# EAGLE design Snake Game (EAGLE 9.6.2)
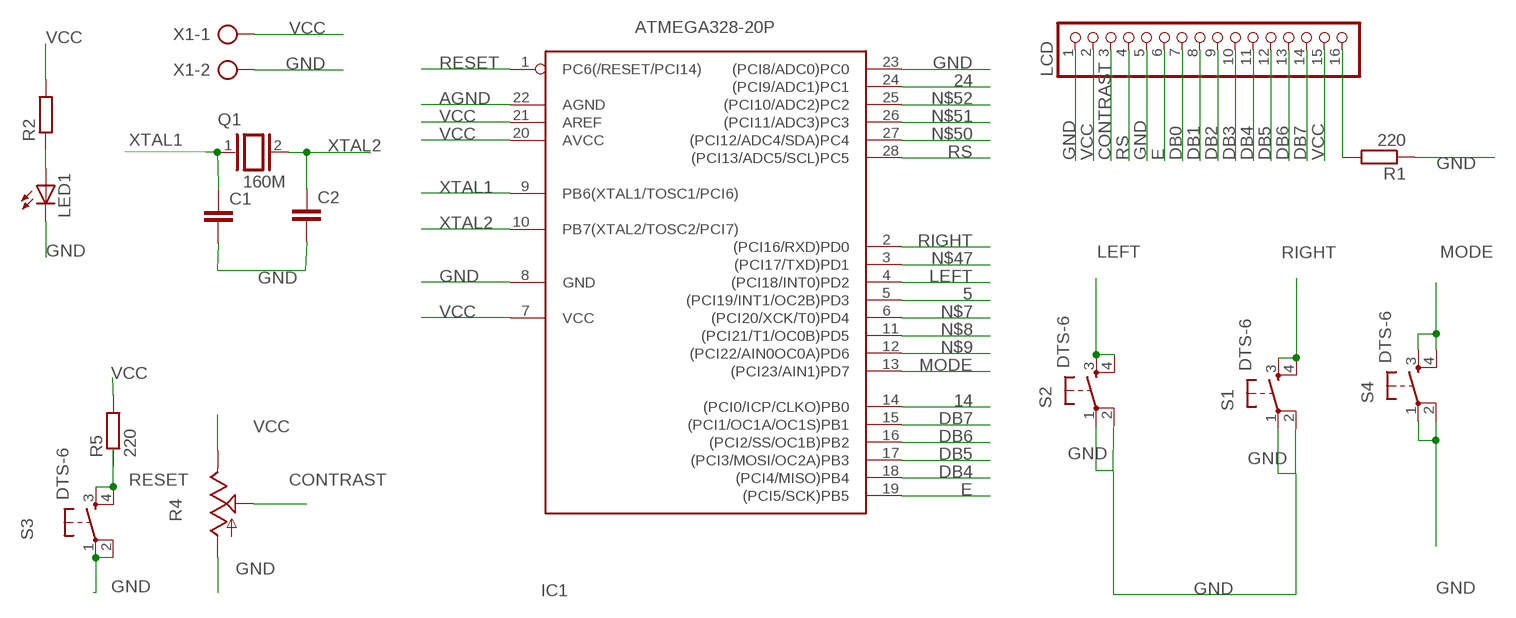
[diagram p0: schematic, sheet 1]

## Parts
C1  C2.5/2  [C2.5-2]
C2  C2.5/2  [C2.5-2]
IC1  ATMEGA328-20P  [DIL28-3]
LCD  PINHD-1X16  [1X16]
LED1  LED_LED3MM  [LED_LED3MM]
Q1  160M  XTAL/S  [QS]
R1  220  R-EU_0204/7  [0204/7]
R2  RCL_R-EU_0204/7  [RCL_0204/7]
R4  TRIM_US-B25P  [B25P]
R5  220  R-EU_0204/7  [0204/7]
S1  DTS-6  [DTS-6]
S2  DTS-6  [DTS-6]
S3  DTS-6  [DTS-6]
S4  DTS-6  [DTS-6]
X1  AK300/2  [AK300/2]

## Nets
5: IC1.5((PCI19/INT1/OC2B)PD3)
14: IC1.14((PCI0/ICP/CLKO)PB0)
24: IC1.24((PCI9/ADC1)PC1)
AGND: IC1.22(AGND)
CONTRAST: LCD.3 R4.S
DB0: LCD.7
DB1: LCD.8
DB2: LCD.9
DB3: LCD.10
DB4: IC1.18((PCI4/MISO)PB4) LCD.11
DB5: IC1.17((PCI3/MOSI/OC2A)PB3) LCD.12
DB6: IC1.16((PCI2/SS/OC1B)PB2) LCD.13
DB7: IC1.15((PCI1/OC1A/OC1S)PB1) LCD.14
E: IC1.19((PCI5/SCK)PB5) LCD.6
GND: C1.2 C2.2 IC1.8(GND) IC1.23((PCI8/ADC0)PC0) LCD.1 LCD.5 LED1.K(C) R1.1 R4.A S1.1 S1.2 S2.1 S2.2 S3.1 S3.2 S4.1 S4.2 X1.2
LEFT: IC1.4((PCI18/INT0)PD2) S2.3 S2.4
MODE: IC1.13((PCI23/AIN1)PD7) S4.3 S4.4
N$1: LCD.16 R1.2
N$3: LED1.A R2.1
N$7: IC1.6((PCI20/XCK/T0)PD4)
N$8: IC1.11((PCI21/T1/OC0B)PD5)
N$9: IC1.12((PCI22/AIN0OC0A)PD6)
N$47: IC1.3((PCI17/TXD)PD1)
N$50: IC1.27((PCI12/ADC4/SDA)PC4)
N$51: IC1.26((PCI11/ADC3)PC3)
N$52: IC1.25((PCI10/ADC2)PC2)
RESET: IC1.1(PC6(/RESET/PCI14)) R5.1 S3.3 S3.4
RIGHT: IC1.2((PCI16/RXD)PD0) S1.3 S1.4
RS: IC1.28((PCI13/ADC5/SCL)PC5) LCD.4
VCC: IC1.7(VCC) IC1.20(AVCC) IC1.21(AREF) LCD.2 LCD.15 R2.2 R4.E R5.2 X1.1
XTAL1: C1.1 IC1.9(PB6(XTAL1/TOSC1/PCI6)) Q1.1
XTAL2: C2.1 IC1.10(PB7(XTAL2/TOSC2/PCI7)) Q1.2

## Library data of the parts
C1 C2 = capacitor-wima:C: CAPACITOR naming: grid - package width
IC1 = atmega328:ATMEGA328*P: MICROCONTROLLER 32 kBytes FLASH 2 kBytes SRAM 1 kBytes EEPROM USART 8-channel 10 bit ADC
LCD = pinhead:PINHD-1X16: PIN HEADER
LED1 = MindCloud:LED_LED: LED OSRAM: - CHIPLED LG R971, LG N971, LY N971, LG Q971, LY Q971, LO R971, LY R971 LH N974, LH R974 LS Q976, LO Q976, LY Q976 LO Q996 - Hyper CHIPLED LW Q18S LB Q993, LB Q99A, LB R99A - SideLED LS A670, LO A670, LY A670, LG A670, LP A670 LB A673, LV A673, LT A673, LW A673 LH A674 LY A675 LS A676, LA A676, LO A676, LY A676, LW A676 LS A679, LY A679, LG A679 - Hyper Micro SIDELED® LS Y876, LA Y876, LO Y876, LY Y876 LT Y87S - SmartLED LW L88C, LW L88S LB L89C, LB L89S, LG L890 LS L89K, LO L89K, LY L89K LS L896, LA L896, LO L896, LY L896 - TOPLED LS T670, LO T670, LY T670, LG T670, LP T670 LSG T670, LSP T670, LSY T670, LOP T670, LYG T670 LG T671, LOG T671, LSG T671 LB T673, LV T673, LT T673, LW T673 LH T674 LS T676, LA T676, LO T676, LY T676, LB T676, LH T676, LSB T676, LW T676 LB T67C, LV T67C, LT T67C, LS T67K, LO T67K, LY T67K, LW E67C LS E67B, LA E67B, LO E67B, LY E67B, LB E67C, LV E67C, LT E67C LW T67C LS T679, LY T679, LG T679 LS T770, LO T770, LY T770, LG T770, LP T770 LB T773, LV T773, LT T773, LW T773 LH T774 LS E675, LA E675, LY E675, LS T675 LS T776, LA T776, LO T776, LY T776, LB T776 LHGB T686 LT T68C, LB T68C - Hyper Mini TOPLED® LB M676 - Mini TOPLED Santana® LG M470 LS M47K, LO M47K, LY M47K Source: http://www.osram.convergy.de LUXEON: - LUMILED® LXK2-PW12-R00, LXK2-PW12-S00, LXK2-PW14-U00, LXK2-PW14-V00 LXK2-PM12-R00, LXK2-PM12-S00, LXK2-PM14-U00 LXK2-PE12-Q00, LXK2-PE12-R00, LXK2-PE12-S00, LXK2-PE14-T00, LXK2-PE14-U00 LXK2-PB12-K00, LXK2-PB12-L00, LXK2-PB12-M00, LXK2-PB14-N00, LXK2-PB14-P00, LXK2-PB14-Q00 LXK2-PR12-L00, LXK2-PR12-M00, LXK2-PR14-Q00, LXK2-PR14-R00 LXK2-PD12-Q00, LXK2-PD12-R00, LXK2-PD12-S00 LXK2-PH12-R00, LXK2-PH12-S00 LXK2-PL12-P00, LXK2-PL12-Q00, LXK2-PL12-R00 Source: www.luxeon.com KINGBRIGHT: KA-3528ASYC Source: www.kingbright.com
Q1 = special:XTAL/S: CRYSTAL
R1 R5 = Eagle Training:R-EU_: RESISTOR, European symbol; SPICEPREFIX: R
R2 = MindCloud:RCL_R-EU_: RESISTOR, European symbol; SPICEPREFIX: R
R4 = pot:TRIM_US-: POTENTIOMETER
S1-S4 = switch-tact:DTS-6
X1 = con-ptr500:AK300/2: CONNECTOR; OC_FARNELL: unknown; OC_NEWARK: unknown

## Board
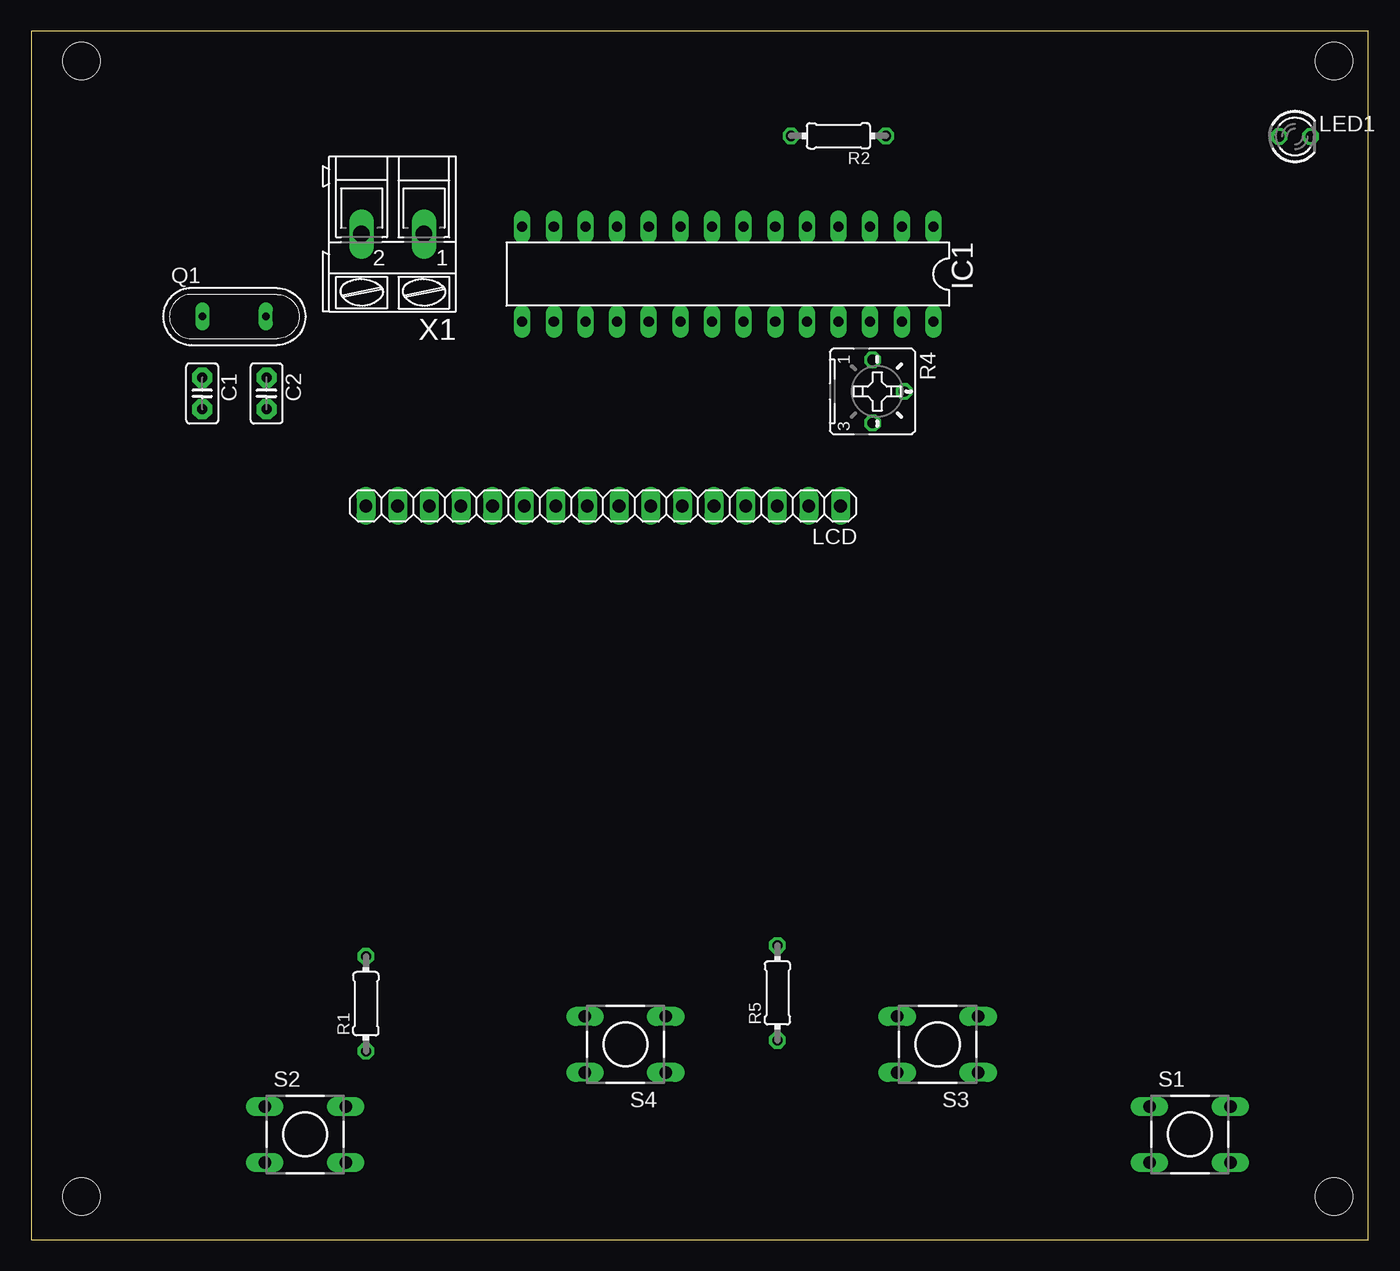
[diagram p1: board, top side]
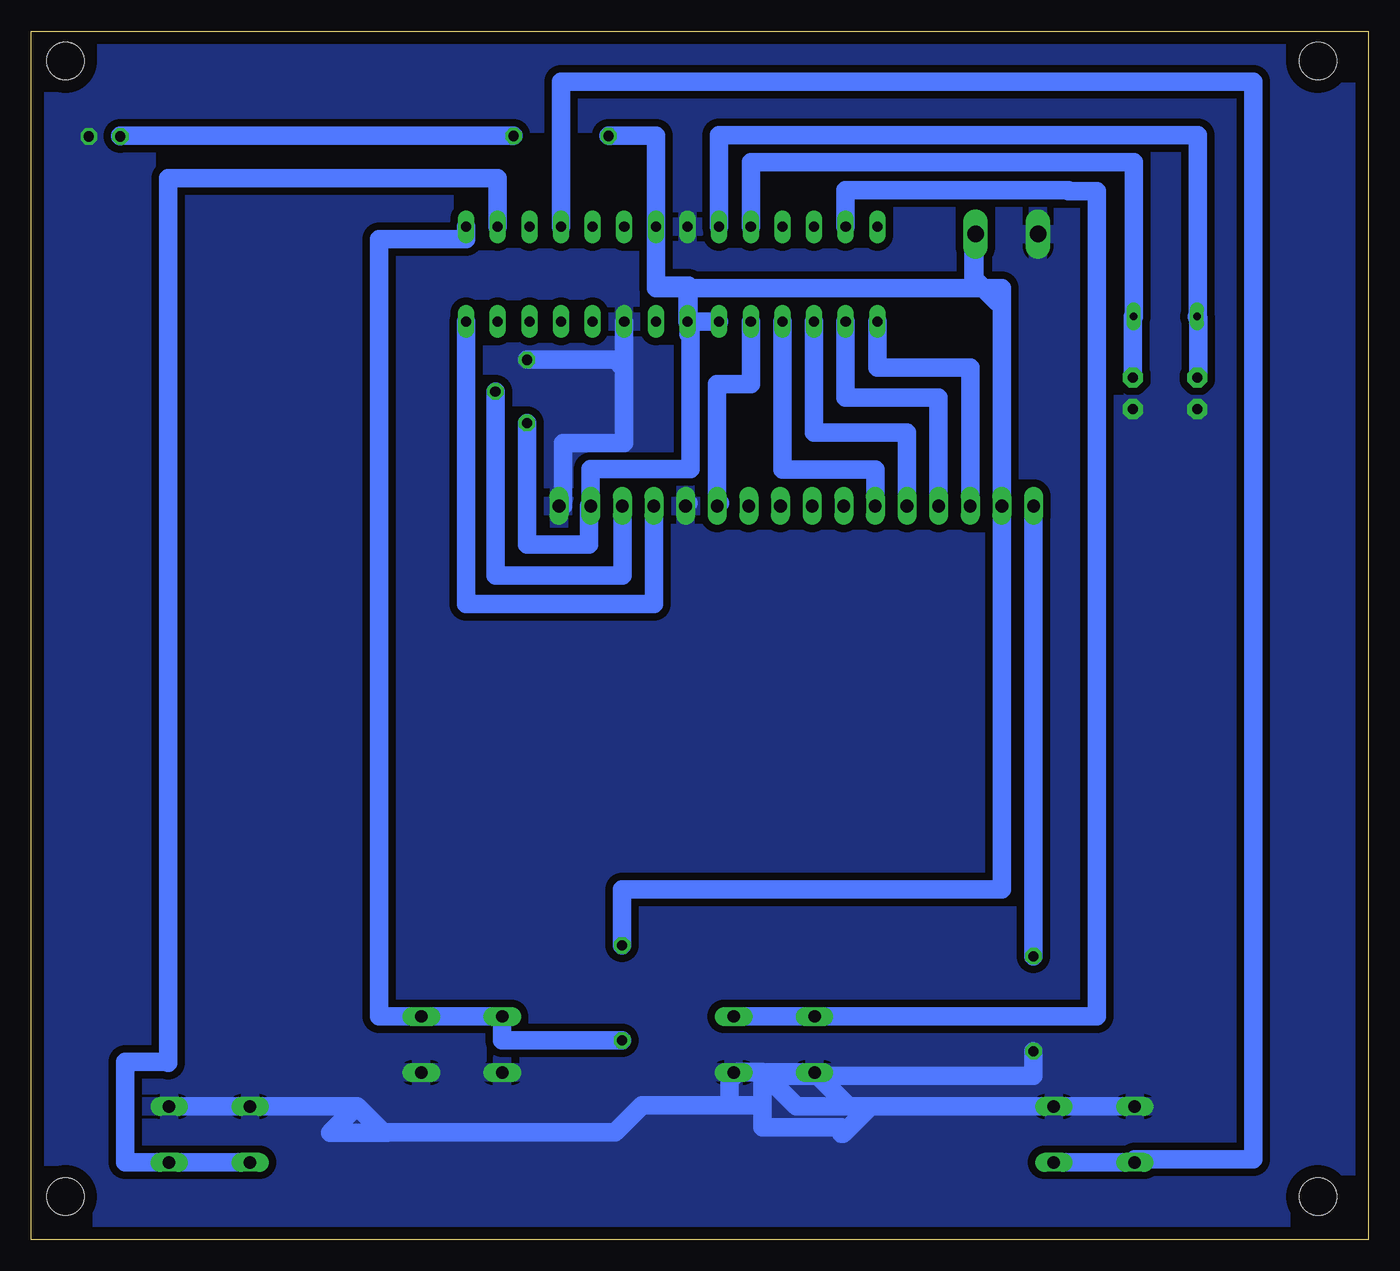
[diagram p2: board, bottom side, seen from below]

Size 107.39 x 97.05 mm. Coordinates in mm from the lower left corner, seen from the top.
Outline: 0,0 107.39,0 107.39,97.05 0,97.05 0,0
Copper layers (1*16): Top 0.035mm / dielectric 1.5mm / Bottom 0.035mm
Design rules "default *": minimum track width 6mil, minimum drill 0.35mm, track to track 0.6mm, track to pad 0.6mm, pad to pad 0.6mm, via to via 0.6mm, smd to smd 0.6mm, copper to edge 40mil, drill to drill 6mil, minimum pad ring 10mil, minimum via ring 8mil, stop-mask expansion 4mil, vias tented up to drill 0mil, thermal gap 10mil
Holes 3 mm at 4.06,94.64 4.06,3.45 104.63,94.64 104.63,3.45

### Footprints (pad centres in the part's own frame; a part is rotated, then mirrored left to right if it is on the bottom)
C2.5-2 = drill 0.813 pad 1.6 octagon: 1 -1.27,0; 2 1.27,0
DIL28-3 = drill 0.813 long: 1 -16.51,-3.81; 2 -13.97,-3.81; 3 -11.43,-3.81; 4 -8.89,-3.81; 5 -6.35,-3.81; 6 -3.81,-3.81; 7 -1.27,-3.81; 8 1.27,-3.81; 9 3.81,-3.81; 10 6.35,-3.81; 11 8.89,-3.81; 12 11.43,-3.81; 13 13.97,-3.81; 14 16.51,-3.81; 15 16.51,3.81; 16 13.97,3.81; 17 11.43,3.81; 18 8.89,3.81; 19 6.35,3.81; 20 3.81,3.81; 21 1.27,3.81; 22 -1.27,3.81; 23 -3.81,3.81; 24 -6.35,3.81; 25 -8.89,3.81; 26 -11.43,3.81; 27 -13.97,3.81; 28 -16.51,3.81
1X16 = drill 1.016 long: 1 -19.05,0; 2 -16.51,0; 3 -13.97,0; 4 -11.43,0; 5 -8.89,0; 6 -6.35,0; 7 -3.81,0; 8 -1.27,0; 9 1.27,0; 10 3.81,0; 11 6.35,0; 12 8.89,0; 13 11.43,0; 14 13.97,0; 15 16.51,0; 16 19.05,0
LED_LED3MM = drill 0.813 octagon: A -1.27,0; K 1.27,0
QS = drill 0.61 long: 1 -2.54,0; 2 2.54,0
0204/7 = drill 0.813 octagon: 1 -3.81,0; 2 3.81,0
RCL_0204/7 = drill 0.813 octagon: 1 -3.81,0; 2 3.81,0
B25P = drill 0.813 octagon: A -2.54,0; E 2.54,0; S 0,2.54
DTS-6 = drill 1 long: 1 -3.25,2.25; 2 3.25,2.25; 3 -3.25,-2.25; 4 3.25,-2.25
AK300/2 = drill 1.321 long: 1 -2.515,0; 2 2.489,0

### Placement (x,y rotation side)
C1  13.74,67.96 270 top
C2  18.91,67.96 270 top
IC1  55.95,77.54 180 top
LCD  45.94,58.92 180 top
LED1  101.49,88.6 0 top
Q1  16.31,74.13 0 top
R1  26.89,18.94 90 top
R2  64.83,88.64 180 top
R4  67.57,68.12 270 top
R5  59.93,19.81 90 top
S1  93.06,8.44 0 top
S2  22.01,8.44 0 top
S3  72.8,15.68 180 top
S4  47.73,15.68 180 top
X1  29.03,80.75 180 top

### Tracks (layer width: path | path; a pad name or v marks a point on that pad's centre or on a via)
CONTRAST
  Bottom 1.5: R4.S 70.11,53.34 59.91,53.34 LCD.3
DB4
  Bottom 1.5: LCD.11 39.59,61.86 47.06,61.86 IC1.18
DB5
  Bottom 1.5: LCD.12 37.05,64.8 44.52,64.8 IC1.17
DB6
  Bottom 1.5: LCD.13 34.51,67.64 41.98,67.64 IC1.16
DB7
  Bottom 1.5: LCD.14 31.97,70.05 39.44,70.05 IC1.15
E
  Bottom 1.5: 52.05,59.16 LCD.6 52.29,68.72 49.6,68.72 IC1.19
GND
  Bottom 1.5: 51.3,10.8 58.33,10.8 60.5,8.62 79.14,8.62 81.21,10.69 81.25,10.69 | 51.3,10.8 48.66,10.8 | 78.81,8.57 83.37,8.57 81.25,10.69 | LCD.1 64.67,58.92 64.67,63.98 59.76,63.98 59.76,69.91 | 26.63,80.75 X1.2 | IC1.23 59.76,69.91 | R4.A 60.5,70.66 59.76,69.91 | 48.66,10.8 48.66,9.02 42.31,9.02 42.31,8.49 42.18,8.49 39.98,10.69 | R1.1 26.89,13.14 48.66,13.14 48.66,10.8 | LCD.5 54.59,59.16 | 81.25,10.69 S1.1 S1.2 | 40.65,10.63 39.98,10.69 | S2.2 39.98,10.69 | S2.2 S2.1 | S4.1 S4.2 41.74,10.69 S2.2 | 51.3,10.8 51.3,12.8 50.63,13.46 48.72,13.46 45.94,10.69 39.98,10.69
  pour Bottom: 0.41,102.86 109.05,102.86 109.05,-6.68 0.41,-6.68
LEFT
  Bottom 1.5: IC1.4 64.84,93 9.25,93 9.25,6.44 18.76,6.44 S2.3 S2.4
MODE
  Bottom 1.5: IC1.13 41.98,84.29 24.09,84.29 24.09,84.19 21.79,84.19 21.79,17.93 S4.4 S4.3
N$1
  Bottom 1.5: LCD.16 26.89,58.92 R1.2
N$3
  Bottom 1.5: R2.1 100.22,88.64 LED1.A
RESET
  Bottom 1.5: IC1.1 72.46,80.35 79.45,80.35 79.45,17.93 S3.3 S3.4 69.55,16 R5.1
RIGHT
  Bottom 1.5: 96.38,14.29 96.38,85.24 69.92,85.24 IC1.2 | S1.3 S1.4 99.82,6.19 99.82,14.29 96.38,14.29 | 96.38,14.29 96.38,14.18
RS
  Bottom 1.5: LCD.4 57.37,51.04 72.46,51.04 IC1.28
VCC
  Bottom 1.5: 29.69,75.53 29.69,75.2 31.63,77.15 31.63,80.66 X1.1 31.71,80.75 31.71,76.42 | 54.42,72.71 54.42,61.88 62.45,61.88 LCD.2 62.57,58.92 62.57,55.84 67.57,55.84 R4.E | 54.42,72.71 54.42,73.73 | IC1.21 54.42,73.73 | 54.42,72.71 54.59,72.71 54.59,75.43 | 54.42,73.73 IC1.20 | 54.59,75.43 54.7,75.53 54.7,76.6 | 57.22,76.42 56.52,76.42 | 54.59,75.43 54.59,76.6 54.68,76.6 | IC1.21 54.68,76.6 | 54.68,76.6 54.7,76.6 | 56.52,76.6 57.22,76.6 IC1.7 57.22,88.64 R2.2 | 56.52,76.42 56.52,76.6 | 56.52,76.6 54.7,76.6 | 31.71,76.42 29.43,76.42 LCD.15 29.43,28.13 59.56,28.13 59.93,28.13 R5.2 | 31.71,76.42 54.68,76.42 | 54.68,76.42 56.52,76.42 | IC1.21 54.68,76.42
XTAL1
  Bottom 1.5: IC1.9 52.14,88.68 13.71,88.68 13.71,74.13 Q1.1 13.66,74.01 13.66,69.31 C1.1
XTAL2
  Bottom 1.5: IC1.10 49.6,86.54 18.85,86.54 Q1.2 18.91,74.13 C2.1

### Text on the board
Document: - | + | Game Joy | Hardware Subteam | Reset | Switch Game | Left / Start / Jump | Right